# Altium schematic sheet SCH-8-ESC6.SchDoc
size Letter
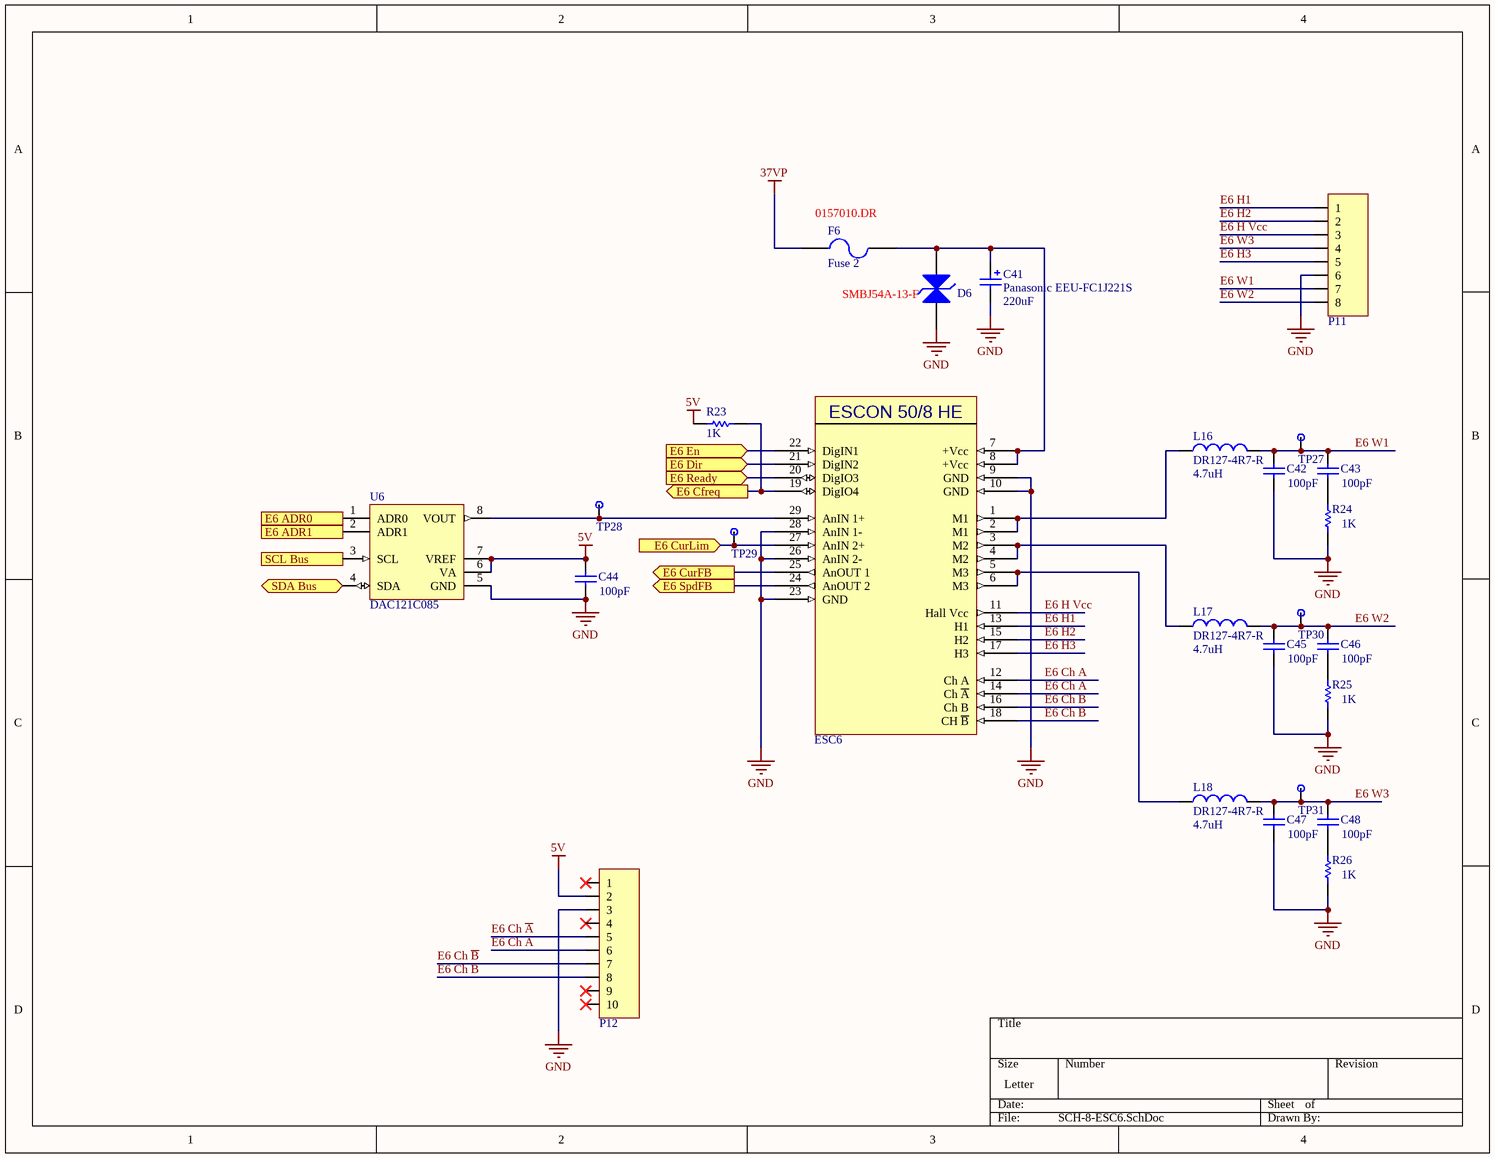
[diagram p0: SCH-8-ESC6.SchDoc]

## Parts
C41  Panasonic EEU-FC1J221S  value 220uF  [Panasonic EEU-FC1J221S]
C42  value 100pF  [C1206]  (hidden comment: Cap Semi)
C43  value 100pF  [C1206]  (hidden comment: Cap Semi)
C44  value 100pF  [C1206]  (hidden comment: Cap Semi)
C45  value 100pF  [C1206]  (hidden comment: Cap Semi)
C46  value 100pF  [C1206]  (hidden comment: Cap Semi)
C47  value 100pF  [C1206]  (hidden comment: Cap Semi)
C48  value 100pF  [C1206]  (hidden comment: Cap Semi)
D6  TVS_DIODE  [SMBJ54A-13-F]  (value not drawn)
ESC6  ESCON 50/8 HE  [ESCON 50/8 HE]  (value not drawn)
F6  Fuse 2  [0157010.DR]
L16  DR127-4R7-R  value 4.7uH  [DR127-4R7-R]
L17  DR127-4R7-R  value 4.7uH  [DR127-4R7-R]
L18  DR127-4R7-R  value 4.7uH  [DR127-4R7-R]
P11  0039281083  [Molex Mini-Fit Jr 0039281083]  (value not drawn)
P12  Header_10_Pos_Ribbon Male  [3M_2510-6002UB]  (value not drawn)
R23  value 1K  [RESC1608X06N_0603]  (hidden comment: Res1)
R24  value 1K  [RESC1608X06N_0603]  (hidden comment: Res1)
R25  value 1K  [RESC1608X06N_0603]  (hidden comment: Res1)
R26  value 1K  [RESC1608X06N_0603]  (hidden comment: Res1)
TP27  TestPt  [50_MIL_PAD]  (value not drawn)
TP28  TestPt  [50_MIL_PAD]  (value not drawn)
TP29  TestPt  [50_MIL_PAD]  (value not drawn)
TP30  TestPt  [50_MIL_PAD]  (value not drawn)
TP31  TestPt  [50_MIL_PAD]  (value not drawn)
U6  DAC121C085  [MUA08A_L]

## Ports
E6 ADR0 (in), E6 ADR1 (in), E6 Cfreq (out), E6 CurFB (out), E6 CurLim (in), E6 Dir (in), E6 En (in), E6 Ready (in), E6 SpdFB (out), SCL Bus (in), SDA Bus (bidir)

## Nets
5V: C44.2 P12.2 R23.2 U6.6(VA) U6.7(VREF)
37VP: F6.1
GND: C41.2 C42.1 C44.1 C45.1 C47.1 D6.1(A) ESC6.9(GND) ESC6.10(GND) ESC6.23(GND) ESC6.26(AnIN_2-) ESC6.28(AnIN_1-) P11.6 P12.3 R24.1 R25.1 R26.1 U6.5(GND)
E6 ADR0: U6.1(ADR0) ; port E6 ADR0
E6 ADR1: U6.2(ADR1) ; port E6 ADR1
E6 Cfreq: ESC6.19(DigIO4) R23.1 ; port E6 Cfreq
E6 Ch A: ESC6.12(Ch_A) P12.6
E6 Ch ~{A}: ESC6.14(Ch_~{A}) P12.5
E6 Ch B: ESC6.16(Ch_B) P12.8
E6 Ch ~{B}: ESC6.18(CH_~{B}) P12.7
E6 CurFB: ESC6.25(AnOUT_1) ; port E6 CurFB
E6 CurLim: ESC6.27(AnIN_2+) TP29.1 ; port E6 CurLim
E6 Dir: ESC6.21(DigIN2) ; port E6 Dir
E6 En: ESC6.22(DigIN1) ; port E6 En
E6 H1: ESC6.13(H1) P11.1
E6 H2: ESC6.15(H2) P11.2
E6 H3: ESC6.17(H3) P11.5
E6 H Vcc: ESC6.11(Hall_Vcc) P11.3
E6 Ready: ESC6.20(DigIO3) ; port E6 Ready
E6 SpdFB: ESC6.24(AnOUT_2) ; port E6 SpdFB
E6 W1: C42.2 C43.2 L16.2 P11.7 TP27.1
E6 W2: C45.2 C46.2 L17.2 P11.8 TP30.1
E6 W3: C47.2 C48.2 L18.2 P11.4 TP31.1
SCL Bus: U6.3(SCL) ; port SCL Bus
SDA Bus: U6.4(SDA) ; port SDA Bus
NetC41_1: C41.1 D6.2(K) ESC6.7(+Vcc) ESC6.8(+Vcc) F6.2
NetC43_1: C43.1 R24.2
NetC46_1: C46.1 R25.2
NetC48_1: C48.1 R26.2
NetESC6_1: ESC6.1(M1) ESC6.2(M1) L16.1
NetESC6_3: ESC6.3(M2) ESC6.4(M2) L17.1
NetESC6_5: ESC6.5(M3) ESC6.6(M3) L18.1
NetESC6_29: ESC6.29(AnIN_1+) TP28.1 U6.8(VOUT)

Not connected (* = marked no-connect by the designer): P12 1* 4* 9* 10*

## Notes on the sheet
- (near F6) 0157010.DR
- (near D6) SMBJ54A-13-F

## Library data of the parts
C41 = Panasonic EEU-FC1J221S: Polarized Capacitor (Radial)
C42-C48 = Cap Semi: Capacitor (Semiconductor SIM Model); Published: 8-Jun-2000; LatestRevisionDate: 29-May-2009; LatestRevisionNote: IPC-7351 Footprint Added.; PackageReference: C1206; Publisher: Altium Limited; PackageDescription: Chip Capacitor
D6 = TVS_DIODE: TVS Diode; Published: 8-Jun-2000; LatestRevisionDate: 17-Jul-2002; LatestRevisionNote: Re-released for DXP Platform.; PackageVersion: Sep-1996; PackageReference: SMC; Publisher: Altium Limited; PackageDescription: DO-214-AB/SMC; 2 C-Bend Leads; Body 7.9 x 5.9 mm, inc. leads (LxW); Code_JEDEC: DO-214-AB
ESC6 = ESCON 50/8 HE: ESCON Module 50/8 HE Servocontroller
F6 = Fuse 2: Fuse; Published: 8-Jun-2000; LatestRevisionDate: 17-Jul-2002; LatestRevisionNote: Re-released for DXP Platform.; PackageReference: PIN-W2/E2.8; Publisher: Altium Limited; PackageDescription: Thru-Hole; 2 Leads
L16-L18 = DR127-4R7-R: 4.7µH Shielded Wirewound Inductor 8.25A 9.17mOhm Nonstandard; Code_IEC: 1005; Published: 8-Jun-2000; LatestRevisionDate: 29-May-2009; LatestRevisionNote: IPC-7351 Footprint Added.; PackageReference: 0402-A; Publisher: Altium Limited; PackageDescription: Chip Inductor; Code_JEITA: 0402
P11 = Molex Mini-Fit Jr 8pos Vert: Mini-Fit Jr, 8 pos 2 row
P12 = Header_10_Pos_Ribbon Male: IDC, 10 pos, Male
R23-R26 = Res1: Resistor; Published: 8-Jun-2000; LatestRevisionDate: 17-Jul-2002; LatestRevisionNote: Re-released for DXP Platform.; PackageReference: AXIAL-0.3; Publisher: Altium Limited; PackageDescription: Axial Device, Thru-Hole; 2 Leads; 0.3 in Pin Spacing
U6 = DAC121C085: 12-Bit Micro Power Digital-to-Analog Converter with an I2C-Compatible Interface and External Reference, 8-pin Mini SOIC, Pb-Free; Manufacturer: National Semiconductor; PackageTopMarking: XTT*X90C; PowerWise: Y; CompType: D/A Converter; ComponentLink3URL: http://www.national.com/packaging/folders/mua08a.html; ComponentLink2URL: http://www.national.com/pf/DA/DAC121C085.html; Code_JEDEC: MO-187-AA; ComponentLink1URL: http://www.national.com/ds/DA/DAC121C085.pdf; RoHS: Y; PackageVersion: revF, Apr-2008; PackageDescription: MINI SOIC, .118 x .118 x .034in, 8 Lead, .0256in Pitch; PackageReference: MUA08A; PinCount: 8; DatasheetVersion: Mar-2008; ComponentLink1Description: DAC121C085 Datasheet; ComponentLink2Description: DAC121C085 Web Page; ComponentLink3Description: MUA08A Package Page; RevisionNote: Component URLs added